# EAGLE design RoverWing-cover-V2.0 (EAGLE 9.5.2)
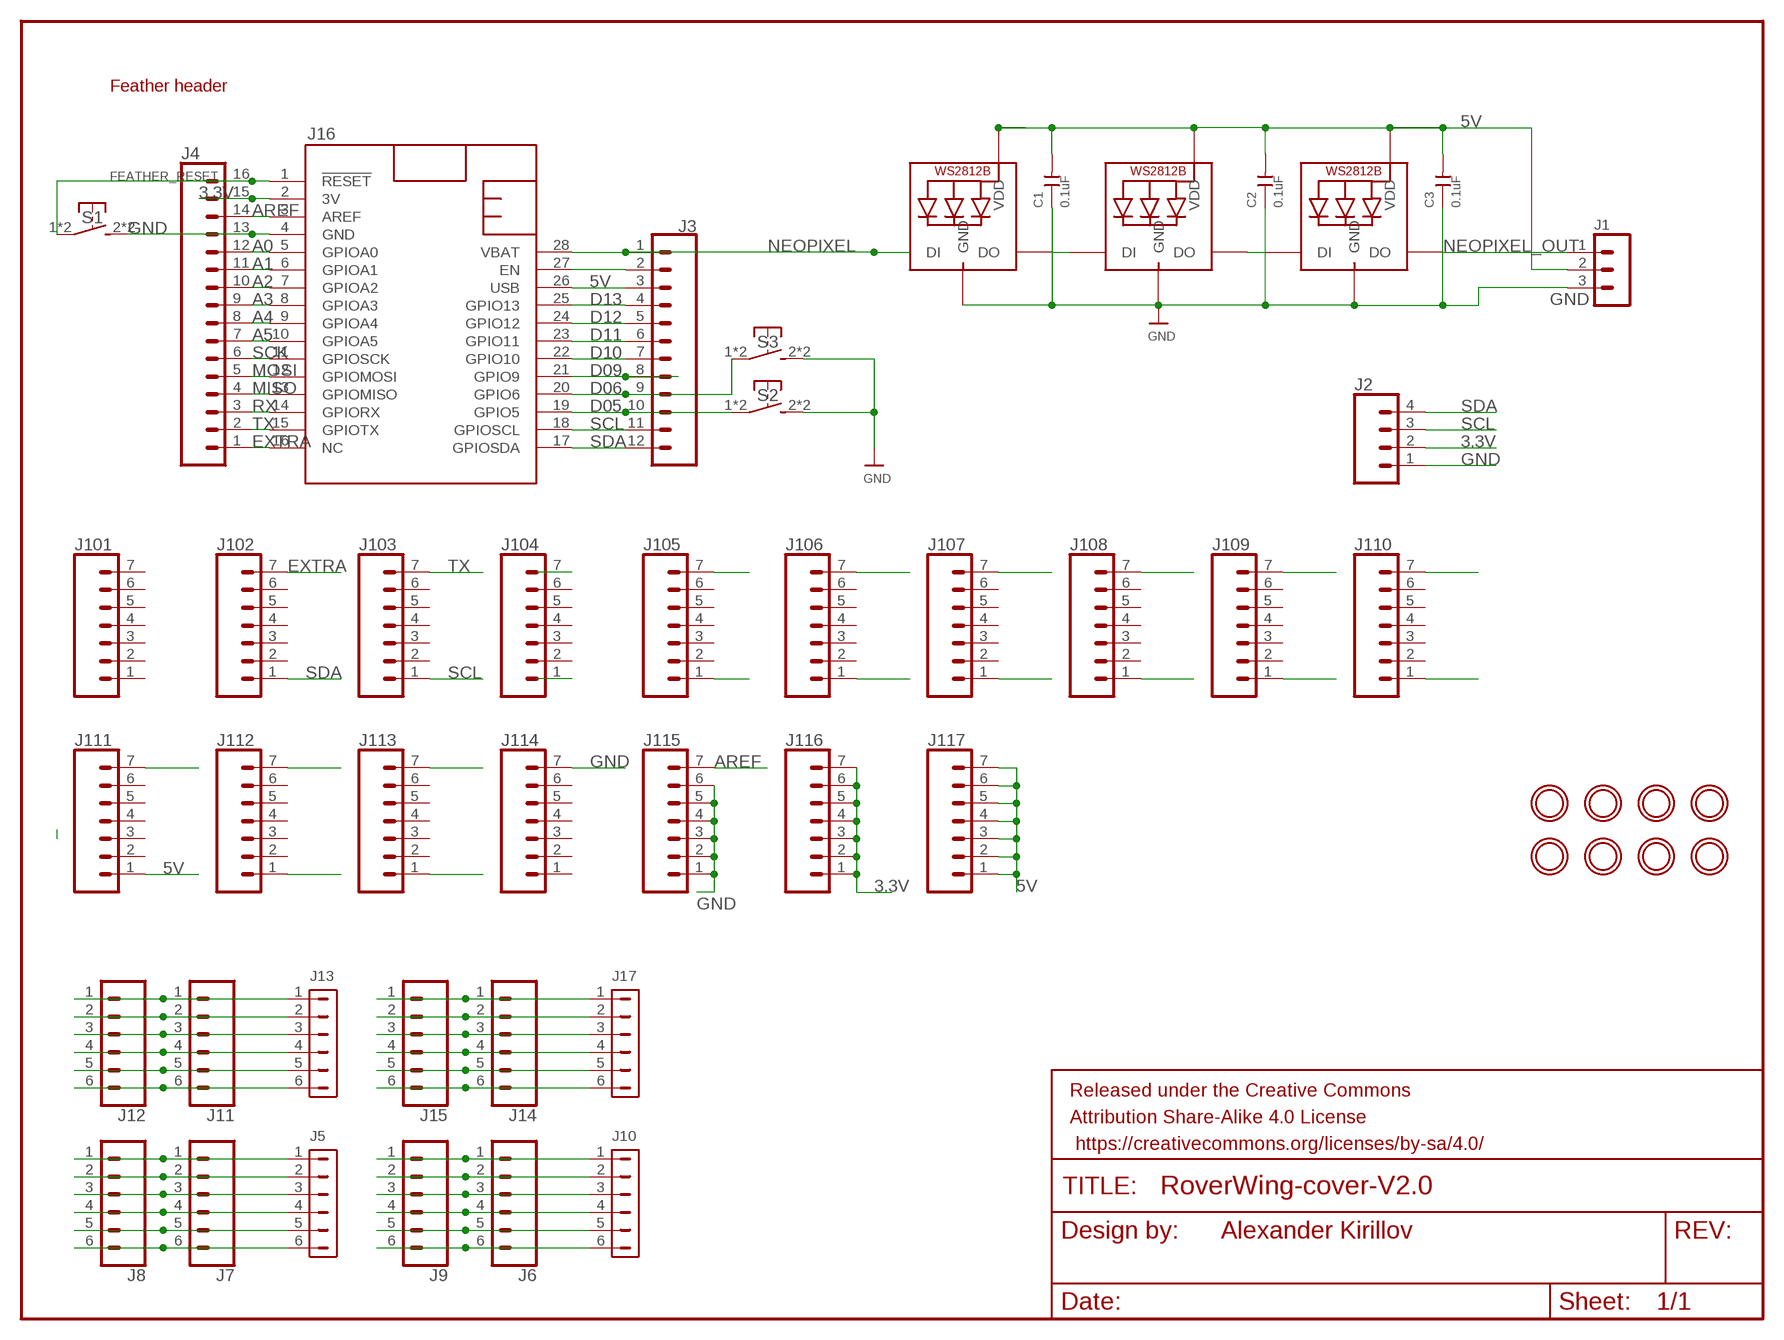
[diagram p0: schematic, sheet 1]

## Parts
C1  0.1uF  CAP-CERAMIC-SMD-0805  [C0805]
C2  0.1uF  CAP-CERAMIC-SMD-0805  [C0805]
C3  0.1uF  CAP-CERAMIC-SMD-0805  [C0805]
FRAME2  FRAME-LETTERNO_PACKAGE  [DUMMY]
J1  HEADER-PH-3PSIDEENTRY  [S3B-PH-K]
J2  CONN_04  [1X04]
J3  CONN_12NO_SILK  [1X12_NO_SILK]
J4  CONN_161X16_NO_SILK  [1X16_NO_SILK]
J5  HEADER-PH-6PSIDEENTRY  [S6B-PH-K]
J6  CONN_06NO_SILK_NO_POP  [1X06_NO_SILK]
J7  CONN_06NO_SILK_NO_POP  [1X06_NO_SILK]
J8  CONN_06NO_SILK_NO_POP  [1X06_NO_SILK]
J9  CONN_06NO_SILK_NO_POP  [1X06_NO_SILK]
J10  HEADER-PH-6PSIDEENTRY  [S6B-PH-K]
J11  CONN_06NO_SILK_NO_POP  [1X06_NO_SILK]
J12  CONN_06NO_SILK_NO_POP  [1X06_NO_SILK]
J13  HEADER-PH-6PSIDEENTRY  [S6B-PH-K]
J14  CONN_06NO_SILK_NO_POP  [1X06_NO_SILK]
J15  CONN_06NO_SILK_NO_POP  [1X06_NO_SILK]
J16  FEATHERWING_NODIM  [FEATHERWING_DIM]
J17  HEADER-PH-6PSIDEENTRY  [S6B-PH-K]
J101  CONN_07NO_SILK  [1X07_NO_SILK]
J102  CONN_07NO_SILK  [1X07_NO_SILK]
J103  CONN_07NO_SILK  [1X07_NO_SILK]
J104  CONN_07NO_SILK  [1X07_NO_SILK]
J105  CONN_07NO_SILK  [1X07_NO_SILK]
J106  CONN_07NO_SILK  [1X07_NO_SILK]
J107  CONN_07NO_SILK  [1X07_NO_SILK]
J108  CONN_07NO_SILK  [1X07_NO_SILK]
J109  CONN_07NO_SILK  [1X07_NO_SILK]
J110  CONN_07NO_SILK  [1X07_NO_SILK]
J111  CONN_07NO_SILK  [1X07_NO_SILK]
J112  CONN_07NO_SILK  [1X07_NO_SILK]
J113  CONN_07NO_SILK  [1X07_NO_SILK]
J114  CONN_07NO_SILK  [1X07_NO_SILK]
J115  CONN_07NO_SILK  [1X07_NO_SILK]
J116  CONN_07NO_SILK  [1X07_NO_SILK]
J117  CONN_07NO_SILK  [1X07_NO_SILK]
LED1  WS2812B3535  [LED3535]
LED2  WS2812B3535  [LED3535]
LED3  WS2812B3535  [LED3535]
S1  SW-TACTILE-4.5X4.5_SMD  [TL3305]
S2  SW-TACTILE-4.5X4.5_SMD  [TL3305]
S3  SW-TACTILE-4.5X4.5_SMD  [TL3305]
U$3  MOUNTINGHOLE3.0_NPH  [MOUNTINGHOLE_3.0_NPH]
U$4  MOUNTINGHOLE3.0_NPH  [MOUNTINGHOLE_3.0_NPH]
U$14  MOUNTINGHOLE3.0_NPH  [MOUNTINGHOLE_3.0_NPH]
U$15  MOUNTINGHOLE3.0_NPH  [MOUNTINGHOLE_3.0_NPH]
U$24  MOUNTINGHOLE3.0_NPH  [MOUNTINGHOLE_3.0_NPH]
U$25  MOUNTINGHOLE3.0_NPH  [MOUNTINGHOLE_3.0_NPH]
U$26  MOUNTINGHOLE3.0_NPH  [MOUNTINGHOLE_3.0_NPH]
U$27  MOUNTINGHOLE3.0_NPH  [MOUNTINGHOLE_3.0_NPH]

## Nets
3.3V: J2.2 J4.15 J16.2(3V) J116.1 J116.2 J116.3 J116.4 J116.5 J116.6 J116.7
5V: C1.2 C2.2 C3.2 J1.2 J3.3 J16.26(USB) J111.1 J117.1 J117.2 J117.3 J117.4 J117.5 J117.6 J117.7 LED1.3(VDD) LED2.3(VDD) LED3.3(VDD)
A0: J4.12 J16.5(GPIOA0) J113.7
A1: J4.11 J16.6(GPIOA1) J112.7
A2: J4.10 J16.7(GPIOA2) J111.7
A3: J4.9 J16.8(GPIOA3) J110.7
A4: J4.8 J16.9(GPIOA4) J109.7
A5: J4.7 J16.10(GPIOA5) J108.7
AREF: J4.14 J16.3(AREF) J115.7
D05: J3.10 J16.19(GPIO5) J104.1 S2.1 S2.4(P1)
D06: J3.9 J16.20(GPIO6) J105.1 S3.1 S3.4(P1)
D09: J3.8 J16.21(GPIO9) J106.1
D10: J3.7 J16.22(GPIO10) J107.1
D11: J3.6 J16.23(GPIO11) J108.1
D12: J3.5 J16.24(GPIO12) J109.1
D13: J3.4 J16.25(GPIO13) J110.1
EXTRA: J4.1 J16.16(NC) J102.7
FEATHER_RESET: J4.16 J16.1(!RESET) S1.1 S1.4(P1)
GND: C1.1 C2.1 C3.1 J1.3 J2.1 J4.13 J16.4(GND) J114.7 J115.1 J115.2 J115.3 J115.4 J115.5 J115.6 LED1.1(GND) LED2.1(GND) LED3.1(GND) S1.2(S1) S1.3(S1) S2.2(S1) S2.3(S1) S3.2(S1) S3.3(S1)
MISO: J4.4 J16.13(GPIOMISO) J105.7
MOSI: J4.5 J16.12(GPIOMOSI) J106.7
N$1: LED2.4(DO) LED3.2(DI)
N$2: J5.1 J7.1 J8.1
N$3: LED1.4(DO) LED2.2(DI)
N$4: J5.2 J7.2 J8.2
N$5: J5.3 J7.3 J8.3
N$6: J113.1
N$7: J5.4 J7.4 J8.4
N$8: J5.5 J7.5 J8.5
N$9: J5.6 J7.6 J8.6
N$10: J6.1 J9.1 J10.1
N$11: J6.2 J9.2 J10.2
N$12: J6.3 J9.3 J10.3
N$13: J6.4 J9.4 J10.4
N$14: J6.5 J9.5 J10.5
N$15: J6.6 J9.6 J10.6
N$16: J11.1 J12.1 J13.1
N$17: J11.2 J12.2 J13.2
N$18: J11.3 J12.3 J13.3
N$19: J11.4 J12.4 J13.4
N$20: J11.5 J12.5 J13.5
N$21: J11.6 J12.6 J13.6
N$22: J14.1 J15.1 J17.1
N$23: J14.2 J15.2 J17.2
N$24: J14.3 J15.3 J17.3
N$25: J14.4 J15.4 J17.4
N$26: J14.5 J15.5 J17.5
N$27: J14.6 J15.6 J17.6
N$37: J3.2 J16.27(EN) J112.1
NEOPIXEL: J3.1 J16.28(VBAT) LED1.2(DI)
NEOPIXEL_OUT: J1.1 LED3.4(DO)
RX: J4.3 J16.14(GPIORX) J104.7
SCK: J4.6 J16.11(GPIOSCK) J107.7
SCL: J2.3 J3.11 J16.18(GPIOSCL) J103.1
SDA: J2.4 J3.12 J16.17(GPIOSDA) J102.1
TX: J4.2 J16.15(GPIOTX) J103.7
Unconnected: J101.1 J101.2 J101.3 J101.4 J101.5 J101.6 J101.7 J102.2 J102.3 J102.4 J102.5 J102.6 J103.2 J103.3 J103.4 J103.5 J103.6 J104.2 J104.3 J104.4 J104.5 J104.6 J105.2 J105.3 J105.4 J105.5 J105.6 J106.2 J106.3 J106.4 J106.5 J106.6 J107.2 J107.3 J107.4 J107.5 J107.6 J108.2 J108.3 J108.4 J108.5 J108.6 J109.2 J109.3 J109.4 J109.5 J109.6 J110.2 J110.3 J110.4 J110.5 J110.6 J111.2 J111.3 J111.4 J111.5 J111.6 J112.2 J112.3 J112.4 J112.5 J112.6 J113.2 J113.3 J113.4 J113.5 J113.6 J114.1 J114.2 J114.3 J114.4 J114.5 J114.6

## Notes on the sheet
- Feather header
- Alexander Kirillov

## Library data of the parts
C1-C3 = RoverWing:CAP-CERAMIC-SMD-0805; MF: AVX; MPN: 04025C104KAT2A; OC_NEWARK: 96Y8186
FRAME2 = SparkFun-Aesthetics:FRAME-LETTER: Schematic Frame - Letter Standard 8.5x11 US Letter frame; DESIGNER: Nobody; OC_NEWARK: unknown; VERSION: v01
J1 = RoverWing:HEADER-PH-3P: HEADER; MF: JST (JAPAN SOLDERLESS TERMINALS); MPN: S3B-PH-K-S (LF)(SN); OC_NEWARK: 38K8070; PARTNO: S3B-PH-K-S(LF)(SN)
J2 = SparkFun-Connectors:CONN_04: Multi connection point. Often used as Generic Header-pin footprint for 0.1 inch spaced/style header connections On any of the 0.1 inch spaced packages, you can populate with these: Break Away Headers - Straight <https://www.sparkfun.com/products/116> (PRT-00116) Break Away Male Headers - Right Angle <https://www.sparkfun.com/products/553> (PRT-00553) Female Headers <https://www.sparkfun.com/products/115> (PRT-00115) Break Away Headers - Machine Pin <https://www.sparkfun.com/products/117> (PRT-00117) Break Away Female Headers - Swiss Machine Pin <https://www.sparkfun.com/products/743> (PRT-00743) For SCREWTERMINALS and SPRING TERMINALS visit here: Screw Terimnals on SparkFun.com <https://www.sparkfun.com/search/results?term=Screw+Terminals> (5mm/3.5mm/2.54mm spacing) This device is also useful as a general connection point to wire up your design to another part of your project. Our various solder wires solder well into these plated through hole pads. Hook-Up Wire - Assortment (Stranded, 22 AWG) <https://www.sparkfun.com/products/11375> (PRT-11375) Hook-Up Wire - Assortment (Solid Core, 22 AWG) <https://www.sparkfun.com/products/11367> (PRT-11367) View the entire wire category on our website here <https://www.sparkfun.com/categories/141> Special notes: Molex polarized connector foot print use with SKU : PRT-08231 with associated crimp pins and housings. 1MM SMD Version SKU: PRT-10208; OC_NEWARK: unknown; PROD_ID: CONN-09696
J3 = SparkFun-Connectors:CONN_12: Multi connection point. Often used as Generic Header-pin footprint for 0.1 inch spaced/style header connections On any of the 0.1 inch spaced packages, you can populate with these: Break Away Headers - Straight <https://www.sparkfun.com/products/116> (PRT-00116) Break Away Male Headers - Right Angle <https://www.sparkfun.com/products/553> (PRT-00553) Female Headers <https://www.sparkfun.com/products/115> (PRT-00115) Break Away Headers - Machine Pin <https://www.sparkfun.com/products/117> (PRT-00117) Break Away Female Headers - Swiss Machine Pin <https://www.sparkfun.com/products/743> (PRT-00743) For SCREWTERMINALS and SPRING TERMINALS visit here: Screw Terimnals on SparkFun.com <https://www.sparkfun.com/search/results?term=Screw+Terminals> (5mm/3.5mm/2.54mm spacing) This device is also useful as a general connection point to wire up your design to another part of your project. Our various solder wires solder well into these plated through hole pads. Hook-Up Wire - Assortment (Stranded, 22 AWG) <https://www.sparkfun.com/products/11375> (PRT-11375) Hook-Up Wire - Assortment (Solid Core, 22 AWG) <https://www.sparkfun.com/products/11367> (PRT-11367) View the entire wire category on our website here <https://www.sparkfun.com/categories/141> Special notes: Molex polarized connector foot print use with SKU : PRT-08231 with associated crimp pins and housings. 1MM SMD Version SKU: PRT-10208 NOTES ON THE VARIANTS LOCK and LOCK_LONGPADS... This footprint was designed to help hold the alignment of a through-hole component (i.e. 6-pin header) while soldering it into place. You may notice that each hole has been shifted either up or down by 0.005 of an inch from it's more standard position (which is a perfectly straight line). This slight alteration caused the pins (the squares in the middle) to touch the edges of the holes. Because they are alternating, it causes a "brace" to hold the component in place. 0.005 has proven to be the perfect amount of "off-center" position when using our standard breakaway headers. Although looks a little odd when you look at the bare footprint, once you have a header in there, the alteration is very hard to notice. Also,if you push a header all the way into place, it is covered up entirely on the bottom side.; OC_NEWARK: unknown
J4 = SparkFun-Connectors:CONN_16: Multi connection point. Often used as Generic Header-pin footprint for 0.1 inch spaced/style header connections On any of the 0.1 inch spaced packages, you can populate with these: Break Away Headers - Straight <https://www.sparkfun.com/products/116> (PRT-00116) Break Away Male Headers - Right Angle <https://www.sparkfun.com/products/553> (PRT-00553) Female Headers <https://www.sparkfun.com/products/115> (PRT-00115) Break Away Headers - Machine Pin <https://www.sparkfun.com/products/117> (PRT-00117) Break Away Female Headers - Swiss Machine Pin <https://www.sparkfun.com/products/743> (PRT-00743) For SCREWTERMINALS and SPRING TERMINALS visit here: Screw Terimnals on SparkFun.com <https://www.sparkfun.com/search/results?term=Screw+Terminals> (5mm/3.5mm/2.54mm spacing) This device is also useful as a general connection point to wire up your design to another part of your project. Our various solder wires solder well into these plated through hole pads. Hook-Up Wire - Assortment (Stranded, 22 AWG) <https://www.sparkfun.com/products/11375> (PRT-11375) Hook-Up Wire - Assortment (Solid Core, 22 AWG) <https://www.sparkfun.com/products/11367> (PRT-11367) View the entire wire category on our website here <https://www.sparkfun.com/categories/141> Special notes: Molex polarized connector foot print use with SKU : PRT-08231 with associated crimp pins and housings. 1MM SMD Version SKU: PRT-10208 NOTES ON THE VARIANTS LOCK and LOCK_LONGPADS... This footprint was designed to help hold the alignment of a through-hole component (i.e. 6-pin header) while soldering it into place. You may notice that each hole has been shifted either up or down by 0.005 of an inch from it's more standard position (which is a perfectly straight line). This slight alteration caused the pins (the squares in the middle) to touch the edges of the holes. Because they are alternating, it causes a "brace" to hold the component in place. 0.005 has proven to be the perfect amount of "off-center" position when using our standard breakaway headers. Although looks a little odd when you look at the bare footprint, once you have a header in there, the alteration is very hard to notice. Also,if you push a header all the way into place, it is covered up entirely on the bottom side.; OC_NEWARK: unknown
J5 J10 J13 J17 = RoverWing:HEADER-PH-6P: JST PH header, 6 pos; OC_NEWARK: unknown
J6-J9 J11 J12 J14 J15 = SparkFun-Connectors:CONN_06: Multi connection point. Often used as Generic Header-pin footprint for 0.1 inch spaced/style header connections On any of the 0.1 inch spaced packages, you can populate with these: Break Away Headers - Straight <https://www.sparkfun.com/products/116> (PRT-00116) Break Away Male Headers - Right Angle <https://www.sparkfun.com/products/553> (PRT-00553) Female Headers <https://www.sparkfun.com/products/115> (PRT-00115) Break Away Headers - Machine Pin <https://www.sparkfun.com/products/117> (PRT-00117) Break Away Female Headers - Swiss Machine Pin <https://www.sparkfun.com/products/743> (PRT-00743) Arduino Stackable Header - 6 Pin <https://www.sparkfun.com/products/9280> (PRT-09280) For SCREWTERMINALS and SPRING TERMINALS visit here: Screw Terimnals on SparkFun.com <https://www.sparkfun.com/search/results?term=Screw+Terminals> (5mm/3.5mm/2.54mm spacing) This device is also useful as a general connection point to wire up your design to another part of your project. Our various solder wires solder well into these plated through hole pads. Hook-Up Wire - Assortment (Stranded, 22 AWG) <https://www.sparkfun.com/products/11375> (PRT-11375) Hook-Up Wire - Assortment (Solid Core, 22 AWG) <https://www.sparkfun.com/products/11367> (PRT-11367) View the entire wire category on our website here <https://www.sparkfun.com/categories/141>; OC_NEWARK: unknown
J16 = RoverWing-cover-V1.6:FEATHERWING: Adafruit Feather; OC_NEWARK: unknown
J101-J117 = SparkFun-Connectors:CONN_07: Multi connection point. Often used as Generic Header-pin footprint for 0.1 inch spaced/style header connections On any of the 0.1 inch spaced packages, you can populate with these: Break Away Headers - Straight <https://www.sparkfun.com/products/116> (PRT-00116) Break Away Male Headers - Right Angle <https://www.sparkfun.com/products/553> (PRT-00553) Female Headers <https://www.sparkfun.com/products/115> (PRT-00115) Break Away Headers - Machine Pin <https://www.sparkfun.com/products/117> (PRT-00117) Break Away Female Headers - Swiss Machine Pin <https://www.sparkfun.com/products/743> (PRT-00743) For SCREWTERMINALS and SPRING TERMINALS visit here: Screw Terimnals on SparkFun.com <https://www.sparkfun.com/search/results?term=Screw+Terminals> (5mm/3.5mm/2.54mm spacing) This device is also useful as a general connection point to wire up your design to another part of your project. Our various solder wires solder well into these plated through hole pads. Hook-Up Wire - Assortment (Stranded, 22 AWG) <https://www.sparkfun.com/products/11375> (PRT-11375) Hook-Up Wire - Assortment (Solid Core, 22 AWG) <https://www.sparkfun.com/products/11367> (PRT-11367) View the entire wire category on our website here <https://www.sparkfun.com/categories/141> Special notes: Molex polarized connector foot print use with SKU : PRT-08231 with associated crimp pins and housings. 1MM SMD Version SKU: PRT-10208 NOTES ON THE VARIANTS LOCK and LOCK_LONGPADS... This footprint was designed to help hold the alignment of a through-hole component (i.e. 6-pin header) while soldering it into place. You may notice that each hole has been shifted either up or down by 0.005 of an inch from it's more standard position (which is a perfectly straight line). This slight alteration caused the pins (the squares in the middle) to touch the edges of the holes. Because they are alternating, it causes a "brace" to hold the component in place. 0.005 has proven to be the perfect amount of "off-center" position when using our standard breakaway headers. Although looks a little odd when you look at the bare footprint, once you have a header in there, the alteration is very hard to notice. Also,if you push a header all the way into place, it is covered up entirely on the bottom side.; OC_NEWARK: unknown
LED1-LED3 = RoverWing-V1.5:WS2812B; MANUFACTURER: Worldsemi; MF: ADAFRUIT; MPN: 2659; OC_NEWARK: 77Y5297; PARTNO: WS2812B-3535
S1-S3 = RoverWing:SW-TACTILE: Tactile Switche; MF: E-SWITCH; MPN: TL3305AF160QG; OC_NEWARK: 84Y2774
U$3 U$4 U$14 U$15 U$24-U$27 = CrickitCopy:MOUNTINGHOLE: Mounting Hole For #2 screws (0.086"/2.18mm width, 0.094"/2.4mm hole) use 2.5mm; OC_NEWARK: unknown

## Net classes
1 thinpower: width 0.305 mm
2 thickpower: width 0.406 mm

## Board
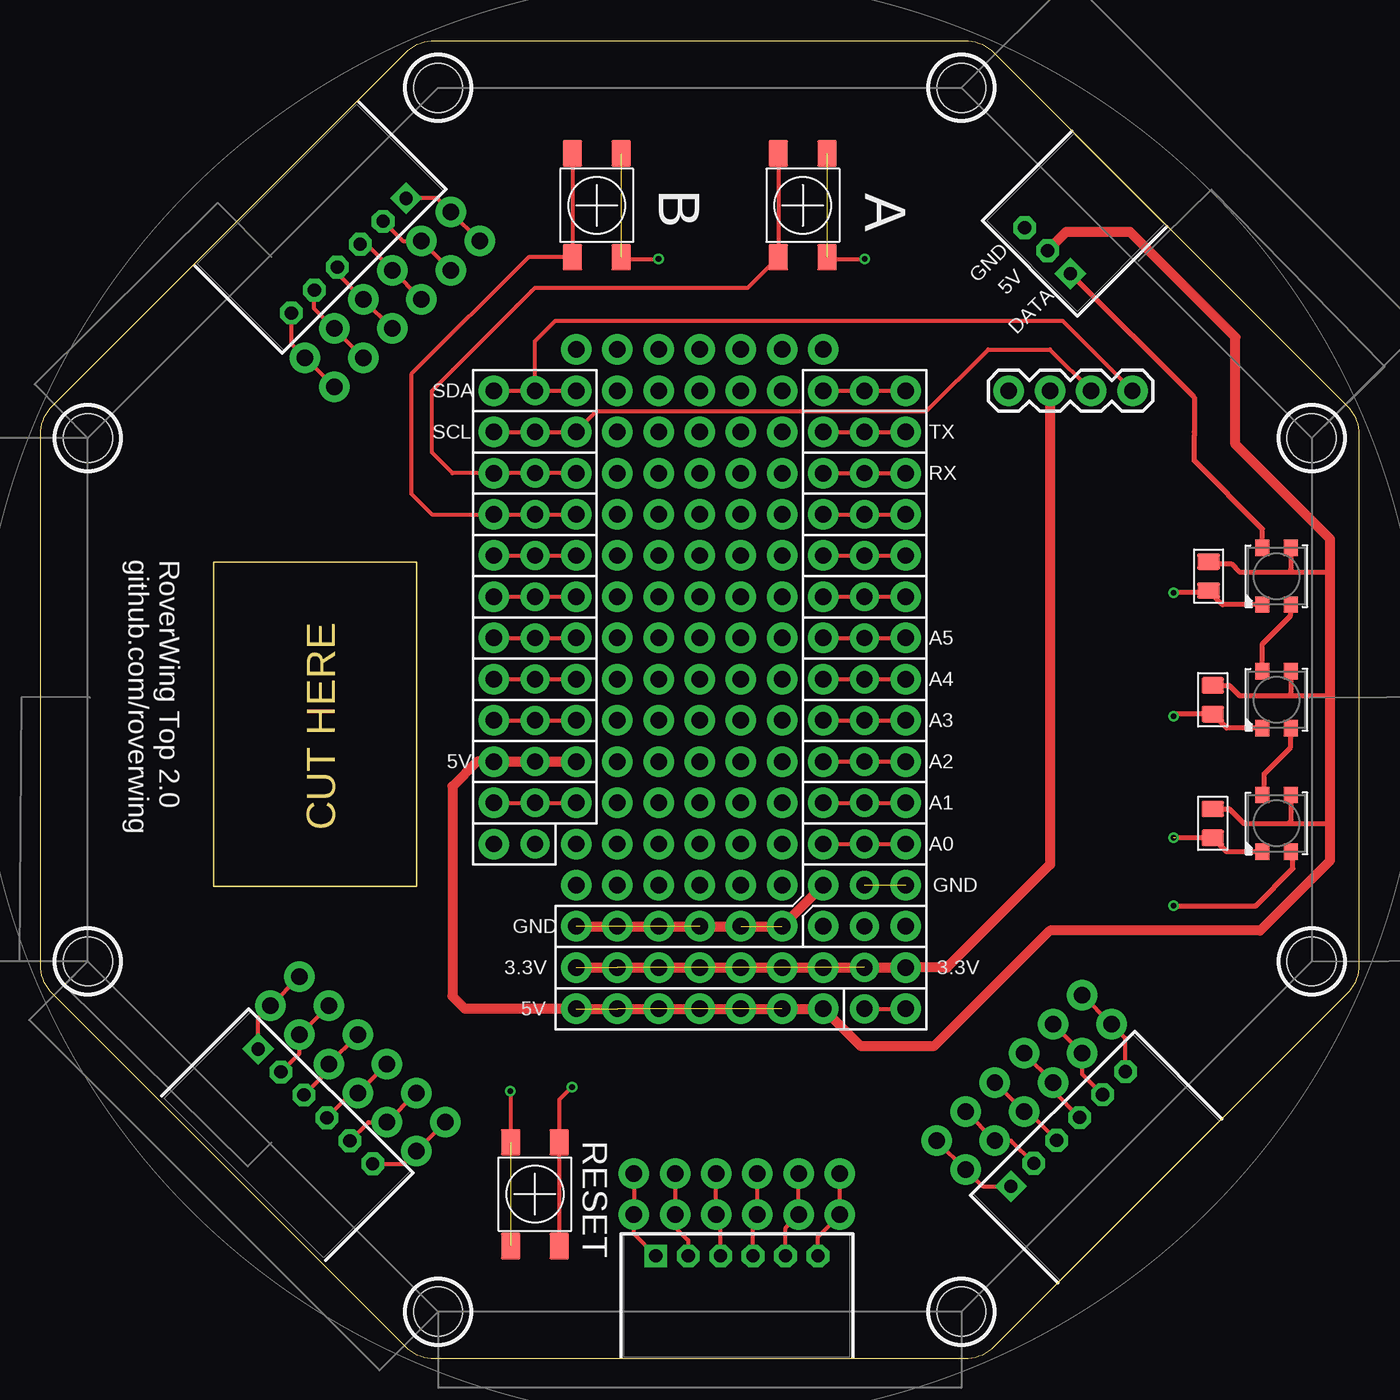
[diagram p1: board, top side]
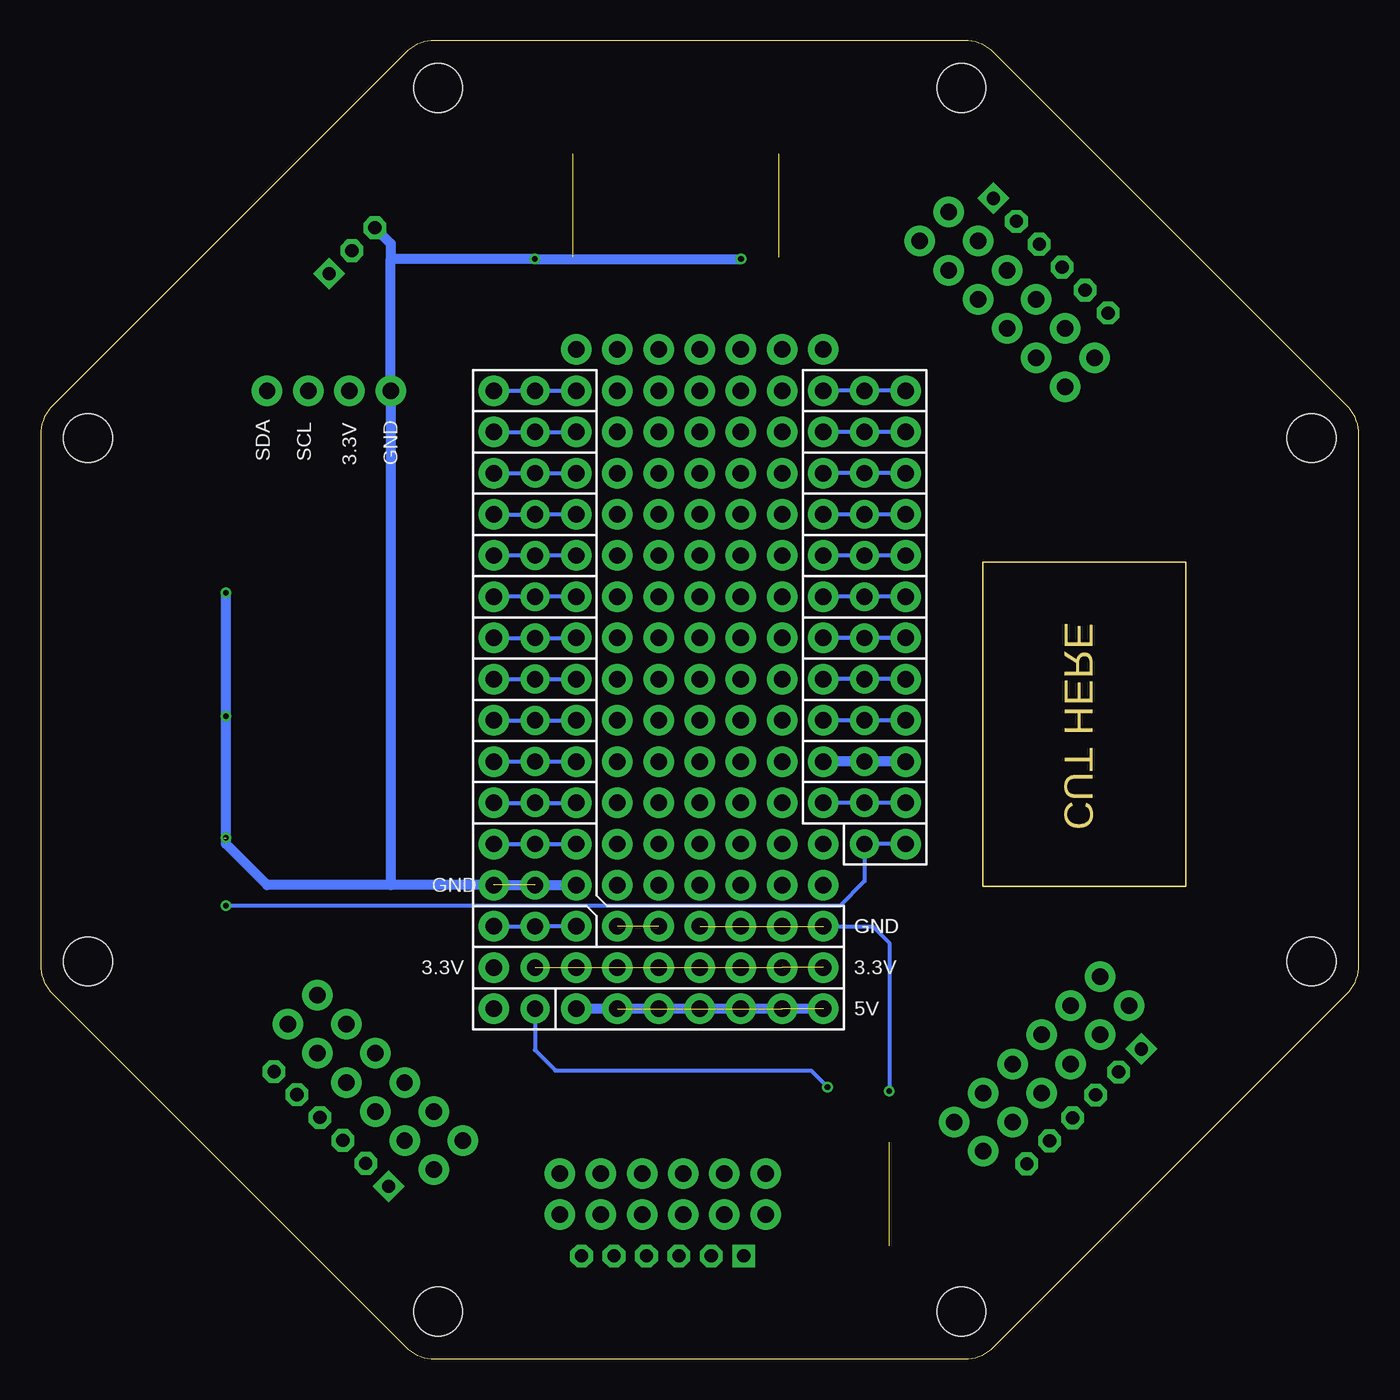
[diagram p2: board, bottom side, seen from below]

Size 81.28 x 81.28 mm. Coordinates in mm from the lower left corner, seen from the top.
Outline: 0,24.29 0,56.99 arc-45 0.74,58.78 22.5,80.54 arc-45 24.29,81.28 56.99,81.28 arc-45 58.78,80.54 80.54,58.78 arc-45 81.28,56.99 81.28,24.29 arc-45 80.54,22.5 58.78,0.74 arc-45 56.99,0 24.29,0 arc-45 22.5,0.74 0.74,22.5 arc-45 0,24.29
Outline: 10.67,49.12 23.17,49.12 23.17,29.12 10.67,29.12 10.67,49.12
Copper layers (1*16): Top 0.035mm / dielectric 1.5mm / Bottom 0.035mm
Design rules "SeeedStudio_2layer_DRU_no_angle_20140221": minimum track width 6mil, minimum drill 12mil, track to track 6mil, track to pad 6mil, pad to pad 6mil, via to via 6mil, smd to smd 0mil, copper to edge 10mil, drill to drill 10mil, minimum pad ring 10mil, minimum via ring 6mil, stop-mask expansion 2mil, vias tented up to drill 100mil, thermal gap 10mil

### Footprints (pad centres in the part's own frame; a part is rotated, then mirrored left to right if it is on the bottom)
C0805 = smd 1.397 x 1.016: 1 0,0.889; 2 0,-0.889
S3B-PH-K = drill 0.813 pad 1.397 square: 1 2,0 | drill 0.813 pad 1.397 octagon: 2 0,0; 3 -2,0
1X04 = drill 1.016 pad 1.88: 1 0,0; 2 2.54,0; 3 5.08,0; 4 7.62,0
1X12_NO_SILK = drill 1.016 pad 1.88: 1 0,0; 2 2.54,0; 3 5.08,0; 4 7.62,0; 5 10.16,0; 6 12.7,0; 7 15.24,0; 8 17.78,0; 9 20.32,0; 10 22.86,0; 11 25.4,0; 12 27.94,0
1X16_NO_SILK = drill 1.016 pad 1.88: 1 0,0; 2 2.54,0; 3 5.08,0; 4 7.62,0; 5 10.16,0; 6 12.7,0; 7 15.24,0; 8 17.78,0; 9 20.32,0; 10 22.86,0; 11 25.4,0; 12 27.94,0; 13 30.48,0; 14 33.02,0; 15 35.56,0; 16 38.1,0
S6B-PH-K = drill 0.813 pad 1.397 square: 1 5,0 | drill 0.813 pad 1.397 octagon: 2 3,0; 3 1,0; 4 -1,0; 5 -3,0; 6 -5,0
1X06_NO_SILK = drill 1.016 pad 1.88: 1 0,0; 2 2.54,0; 3 5.08,0; 4 7.62,0; 5 10.16,0; 6 12.7,0
FEATHERWING_DIM = drill 1 pad 1.778: 1 6.35,1.27; 2 8.89,1.27; 3 11.43,1.27; 4 13.97,1.27; 5 16.51,1.27; 6 19.05,1.27; 7 21.59,1.27; 8 24.13,1.27; 9 26.67,1.27; 10 29.21,1.27; 11 31.75,1.27; 12 34.29,1.27; 13 36.83,1.27; 14 39.37,1.27; 15 41.91,1.27; 16 44.45,1.27; 17 44.45,21.59; 18 41.91,21.59; 19 39.37,21.59; 20 36.83,21.59; 21 34.29,21.59; 22 31.75,21.59; 23 29.21,21.59; 24 26.67,21.59; 25 24.13,21.59; 26 21.59,21.59; 27 19.05,21.59; 28 16.51,21.59
1X07_NO_SILK = drill 1.016 pad 1.88: 1 0,0; 2 2.54,0; 3 5.08,0; 4 7.62,0; 5 10.16,0; 6 12.7,0; 7 15.24,0
LED3535 = smd 1 x 0.85: 1 -1.75,0.875; 2 -1.75,-0.875; 3 1.75,-0.875; 4 1.75,0.875
TL3305 = smd 1.6 x 1.2: 1 -3.2,1.5; 2 -3.2,-1.5; 3 3.2,-1.5; 4 3.2,1.5
MOUNTINGHOLE_3.0_NPH = hole 3: 0,0

### Placement (x,y rotation side)
C1  72.26,33.02 180 top
C2  72.26,40.64 180 top
C3  72.01,48.26 180 top
FRAME2  77.85,82.17 0 top
J1  62.08,68.33 315 top
J2  59.69,59.69 0 top
J3  27.94,31.75 90 top
J4  53.34,59.69 270 top
J5  16.94,15.57 135 top
J6  55.24,13.46 45 top
J7  15.97,23.58 315 top
J8  14.18,21.78 315 top
J9  57.04,11.66 45 top
J10  63.35,14.18 225 top
J11  27.08,68.91 225 top
J12  25.29,70.71 225 top
J13  19,68.02 45 top
J14  36.58,11.43 0 top
J15  36.58,8.89 0 top
J16  52.07,15.24 90 top
J17  42.93,6.35 180 top
J101  33.02,62.23 0 top
J102  33.02,59.69 0 top
J103  33.02,57.15 0 top
J104  33.02,54.61 0 top
J105  33.02,52.07 0 top
J106  33.02,49.53 0 top
J107  33.02,46.99 0 top
J108  33.02,44.45 0 top
J109  33.02,41.91 0 top
J110  33.02,39.37 0 top
J111  33.02,36.83 0 top
J112  33.02,34.29 0 top
J113  33.02,31.75 0 top
J114  33.02,29.21 0 top
J115  33.02,26.67 0 top
J116  33.02,24.13 0 top
J117  33.02,21.59 0 top
LED1  76.2,33.02 90 top
LED2  76.2,40.64 90 top
LED3  76.2,48.26 90 top
S1  30.48,10.16 270 top
S2  46.99,71.12 90 top
S3  34.29,71.12 90 top
U$3  24.51,2.92 0 top
U$4  56.77,2.92 0 top
U$14  2.92,24.51 0 top
U$15  2.92,56.77 0 top
U$24  78.36,24.51 0 top
U$25  78.36,56.77 0 top
U$26  24.51,78.36 0 top
U$27  56.77,78.36 0 top

### Tracks (layer width: path | path; a pad name or v marks a point on that pad's centre or on a via)
3.3V  (7 unrouted)
  Top 0.61: J2.2 62.23,30.48 55.88,24.13 J4.15 J116.1
5V  (5 unrouted)
  Top 0.305: C3.2 72.14,49.02 73.41,49.02 73.91,48.51 77.22,48.51 | 77.22,48.51 79.5,48.51 | LED3.3 77.08,48.66 77.22,48.51 | C2.2 73.28,41.53 73.91,40.89 76.96,40.89 | 76.96,40.89 79.5,40.89 | LED2.3 77.08,41.01 76.96,40.89 | C1.2 73.28,33.91 74.17,33.02 76.96,33.02 | 76.96,33.02 79.5,33.02 | LED1.3 77.08,33.13 76.96,33.02
  Top 0.61: J111.1 J16.26 J3.3 26.92,36.83 25.4,35.31 25.4,22.35 26.16,21.59 J117.1 J117.7 48.51,21.34 50.55,19.3 55.12,19.3 62.23,26.42 75.18,26.42 79.5,30.73 79.5,33.02 79.5,40.89 79.5,48.51 79.5,50.55 73.66,56.39 73.66,62.99 67.18,69.47 63.22,69.47 J1.2
  Bottom 0.61: J117.1 J117.7 | J3.3 J111.1
A0
  Top 0.254: J113.7 J4.12
  Bottom 0.254: J4.12 J16.5 J113.7
A1
  Top 0.254: J112.7 J4.11
  Bottom 0.254: J4.11 J16.6 J112.7
A2
  Top 0.254: J111.7 J4.10
  Bottom 0.254: J4.10 J16.7 J111.7
A3
  Top 0.254: J110.7 J4.9
  Bottom 0.254: J4.9 J16.8 J110.7
A4
  Top 0.254: J109.7 J4.8
  Bottom 0.254: J4.8 J16.9 J109.7
A5
  Top 0.254: J108.7 J4.7
  Bottom 0.254: J4.7 J16.10 J108.7
AREF
  Bottom 0.254: J4.14 J16.3 J115.7
D05
  Top 0.254: J104.1 J3.10 25.4,54.61 24.13,55.88 24.13,59.69 30.48,66.04 43.61,66.04 S2.1 S2.4
  Bottom 0.254: J3.10 J16.19 J104.1
D06
  Top 0.254: J105.1 J3.9 24.13,52.07 22.86,53.34 22.86,60.71 30.07,67.92 S3.1 S3.4
  Bottom 0.254: J3.9 J16.20 J105.1
D09
  Top 0.254: J3.8 J106.1
  Bottom 0.254: J3.8 J16.21 J106.1
D10
  Top 0.254: J3.7 J107.1
  Bottom 0.254: J3.7 J16.22 J107.1
D11
  Top 0.254: J3.6 J108.1
  Bottom 0.254: J3.6 J16.23 J108.1
D12
  Top 0.254: J3.5 J109.1
  Bottom 0.254: J3.5 J16.24 J109.1
D13
  Top 0.254: J3.4 J110.1
  Bottom 0.254: J3.4 J16.25 J110.1
EXTRA
  Top 0.254: J102.7 J4.1
  Bottom 0.254: J102.7 J16.16 J4.1
FEATHER_RESET  (via drill 0.35)
  Top 0.254: J16.1 J4.16 | v32.77,16.76 31.98,15.98 S1.1 S1.4
  Bottom 0.254: J16.1 50.8,19.05 49.53,17.78 33.78,17.78 v32.77,16.76
GND  (via drill 0.35)  (9 unrouted)
  Top 0.254: S3.2 35.89,67.82 v38.1,67.82 | S2.2 48.59,67.82 v50.8,67.82 | v28.96,16.51 28.98,16.49 S1.2
  Top 0.305: LED3.1 72.87,46.51 C3.1 71.88,47.24 v69.85,47.24 | v69.85,39.62 69.98,39.75 C2.1 73.12,38.89 LED2.1 | 69.85,32.26 69.98,32.13 C1.1 73.12,31.27 LED1.1
  Top 0.61: J114.7 J115.6 J115.1
  Bottom 0.254: J115.1 29.97,26.67 28.96,25.65 v28.96,16.51
  Bottom 0.61: 59.69,29.21 J4.13 J114.7 | 59.69,29.21 67.31,29.21 69.85,31.75 v69.85,32.13 v69.85,39.62 v69.85,47.24 | v38.1,67.82 v50.8,67.82 59.69,67.82 | 59.69,29.21 J2.1 59.69,67.82 | J1.3 59.69,68.76 59.69,67.82
MISO
  Top 0.254: J105.7 J4.4
  Bottom 0.254: J105.7 J16.13 J4.4
MOSI
  Top 0.254: J106.7 J4.5
  Bottom 0.254: J106.7 J16.12 J4.5
N$1
  Top 0.305: LED2.4 75.33,44.08 77.08,45.83 LED3.2
N$2
  Top 0.254: J5.1 13.41,21.01 J8.1 J7.1 | J7.1
N$3
  Top 0.305: LED1.4 75.44,34.88 75.44,36.07 77.08,37.7 LED2.2
N$4
  Top 0.254: J7.2 J8.2 | J8.2 | J5.2 15.97,18.84 J8.2
N$5
  Top 0.254: J5.3 17.77,17.81 J8.3 J7.3 | J7.3
N$7
  Top 0.254: J5.4 19.18,16.39 J8.4 J7.4 | J7.4
N$8
  Top 0.254: J5.5 20.21,14.6 J8.5 J7.5 | J7.5
N$9
  Top 0.254: J5.6 22.39,12.03 J8.6 J7.6 | J7.6
N$10
  Top 0.254: J6.1 J9.1 | J9.1 | J9.1 58.05,10.64 J10.1
N$11
  Top 0.254: J10.2 59.83,13.46 J9.2 J6.2 | J6.2
N$12
  Top 0.254: J10.3 60.87,15.25 J9.3 J6.3 | J6.3
N$13
  Top 0.254: J10.4 62.43,16.52 J9.4 J6.4 | J6.4
N$14
  Top 0.254: J10.5 64.22,17.55 J9.5 | J9.5 | J9.5 J6.5
N$15
  Top 0.254: J10.6 66.89,19.77 J9.6 | J9.6 | J9.6 J6.6
N$16
  Top 0.254: J11.1 J12.1 24.45,71.55 J13.1
N$17
  Top 0.254: J13.2 22.35,68.91 J12.2 J11.2
N$18
  Top 0.254: J11.3 J12.3 20.09,68.72 J13.3
N$19
  Top 0.254: J11.4 J12.4 18.29,66.93 J13.4
N$20
  Top 0.254: J11.5 J12.5 16.88,64.75 J13.5
N$21
  Top 0.254: J11.6 J12.6 15.47,62.57 J13.6
N$22
  Top 0.254: J14.1 J15.1 36.58,7.7 J17.1
N$23
  Top 0.254: J14.2 J15.2 39.12,8.13 39.93,7.32 J17.2
N$24
  Top 0.254: J17.3 41.93,8.62 J15.3 J14.3
N$25
  Top 0.254: J17.4 43.93,8.62 J15.4 J14.4
N$26
  Top 0.254: J17.5 45.93,8.08 J15.5 J14.5
N$27
  Top 0.254: J17.6 47.93,7.54 J15.6 J14.6
N$37
  Top 0.254: J3.2 J16.27 J112.1
  Bottom 0.254: J3.2 J112.1
NEOPIXEL  (via drill 0.35)
  Top 0.305: v69.85,27.94 74.93,27.94 77.22,30.23 77.22,31.13 LED1.2
  Bottom 0.254: v69.85,27.94 32,27.94 30.48,29.46 J16.28 J3.1
NEOPIXEL_OUT
  Top 0.305: J1.1 71.12,59.29 71.12,57.15 71.12,56.9 71.12,55.38 75.33,51.17 LED3.4
RX
  Top 0.254: J104.7 J4.3
  Bottom 0.254: J4.3 J16.14 J104.7
SCK
  Top 0.254: J107.7 J4.6
  Bottom 0.254: J107.7 J16.11 J4.6
SCL
  Top 0.254: J2.3 62.23,62.23 58.42,62.23 54.61,58.42 34.29,58.42 J103.1 J3.11
  Bottom 0.254: J103.1 J16.18 J3.11
SDA
  Top 0.254: J16.17 30.48,62.74 31.75,64.01 62.99,64.01 J2.4 | J3.12 J102.1
  Bottom 0.254: J3.12 J16.17 J102.1
TX
  Top 0.254: J103.7 53.59,57.15
  Bottom 0.254: J4.2 J16.15 J103.7

### Text on the board
Dimension: CUT HERE
tNames: B | A | GND | 5V | DATA | SDA | SCL | TX | RX | RoverWing Top 2.0 / github.com/roverwing | A5 | A4 | A3 | 5V | A2 | A1 | A0 | GND | GND | 3.3V | 3.3V | 5V | RESET
bNames: SCL | SDA | GND | 3.3V | GND | GND | GND | 3.3V | 3.3V | 5V